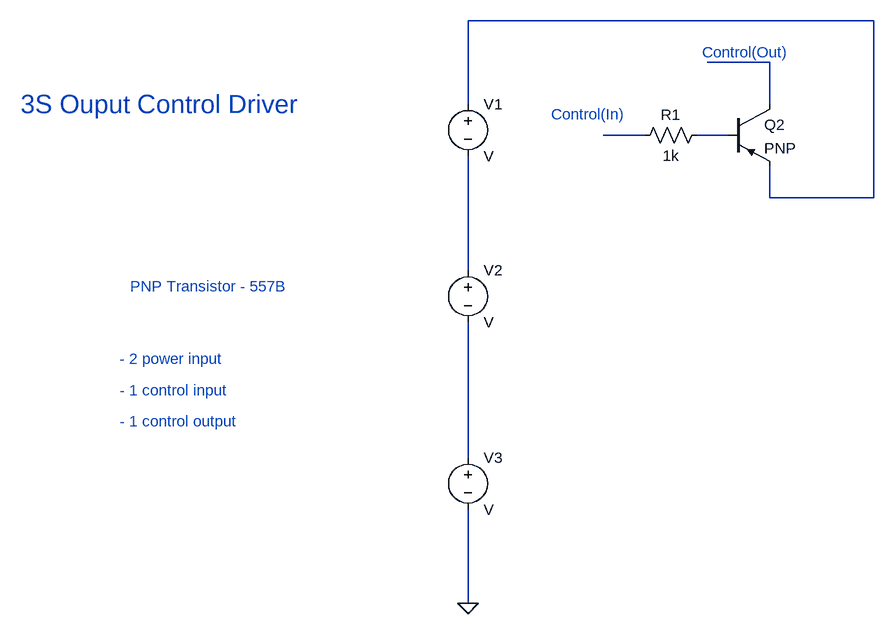
[diagram p0: schematic 3S Output Control Driver.asc]
3S Output Control Driver.asc, the LTspice schematic file:
Version 4
SHEET 1 880 820
WIRE 800 -96 176 -96
WIRE 640 -32 544 -32
WIRE 176 32 176 -96
WIRE 640 32 640 -32
WIRE 448 80 384 80
WIRE 576 80 528 80
WIRE 640 176 640 128
WIRE 800 176 800 -96
WIRE 800 176 640 176
WIRE 176 288 176 112
WIRE 176 576 176 368
WIRE 176 800 176 656
FLAG 176 800 0
SYMBOL voltage 176 16 R0
SYMATTR InstName V1
SYMBOL voltage 176 272 R0
SYMATTR InstName V2
SYMBOL voltage 176 560 R0
SYMATTR InstName V3
SYMBOL res 544 64 R90
WINDOW 0 0 56 VBottom 2
WINDOW 3 32 56 VTop 2
SYMATTR InstName R1
SYMATTR Value 1k
SYMBOL pnp 576 32 R0
SYMATTR InstName Q2
TEXT 536 -48 Left 2 ;Control(Out)
TEXT 304 48 Left 2 ;Control(In)
TEXT -512 32 Left 4 ;3S Ouput Control Driver
TEXT -344 312 Left 2 ;PNP Transistor - 557B
TEXT -360 424 Left 2 ;- 2 power input
TEXT -360 472 Left 2 ;- 1 control input
TEXT -360 520 Left 2 ;- 1 control output

The netlist it stands for:
* 3S Output Control Driver.asc
V1 N001 N005 V
V2 N005 N006 V
V3 N006 0 V
R1 N004 N003 1k
Q2 N002 N004 N001 0 PNP
.model NPN NPN
.model PNP PNP
.lib standard.bjt
* Control(Out)
* Control(In)
* 3S Ouput Control Driver
* PNP Transistor - 557B
* - 2 power input
* - 1 control input
* - 1 control output
.backanno
.end